# EAGLE design plugV15-smd-5x5cm-no-screen-value (EAGLE 7.5.0)
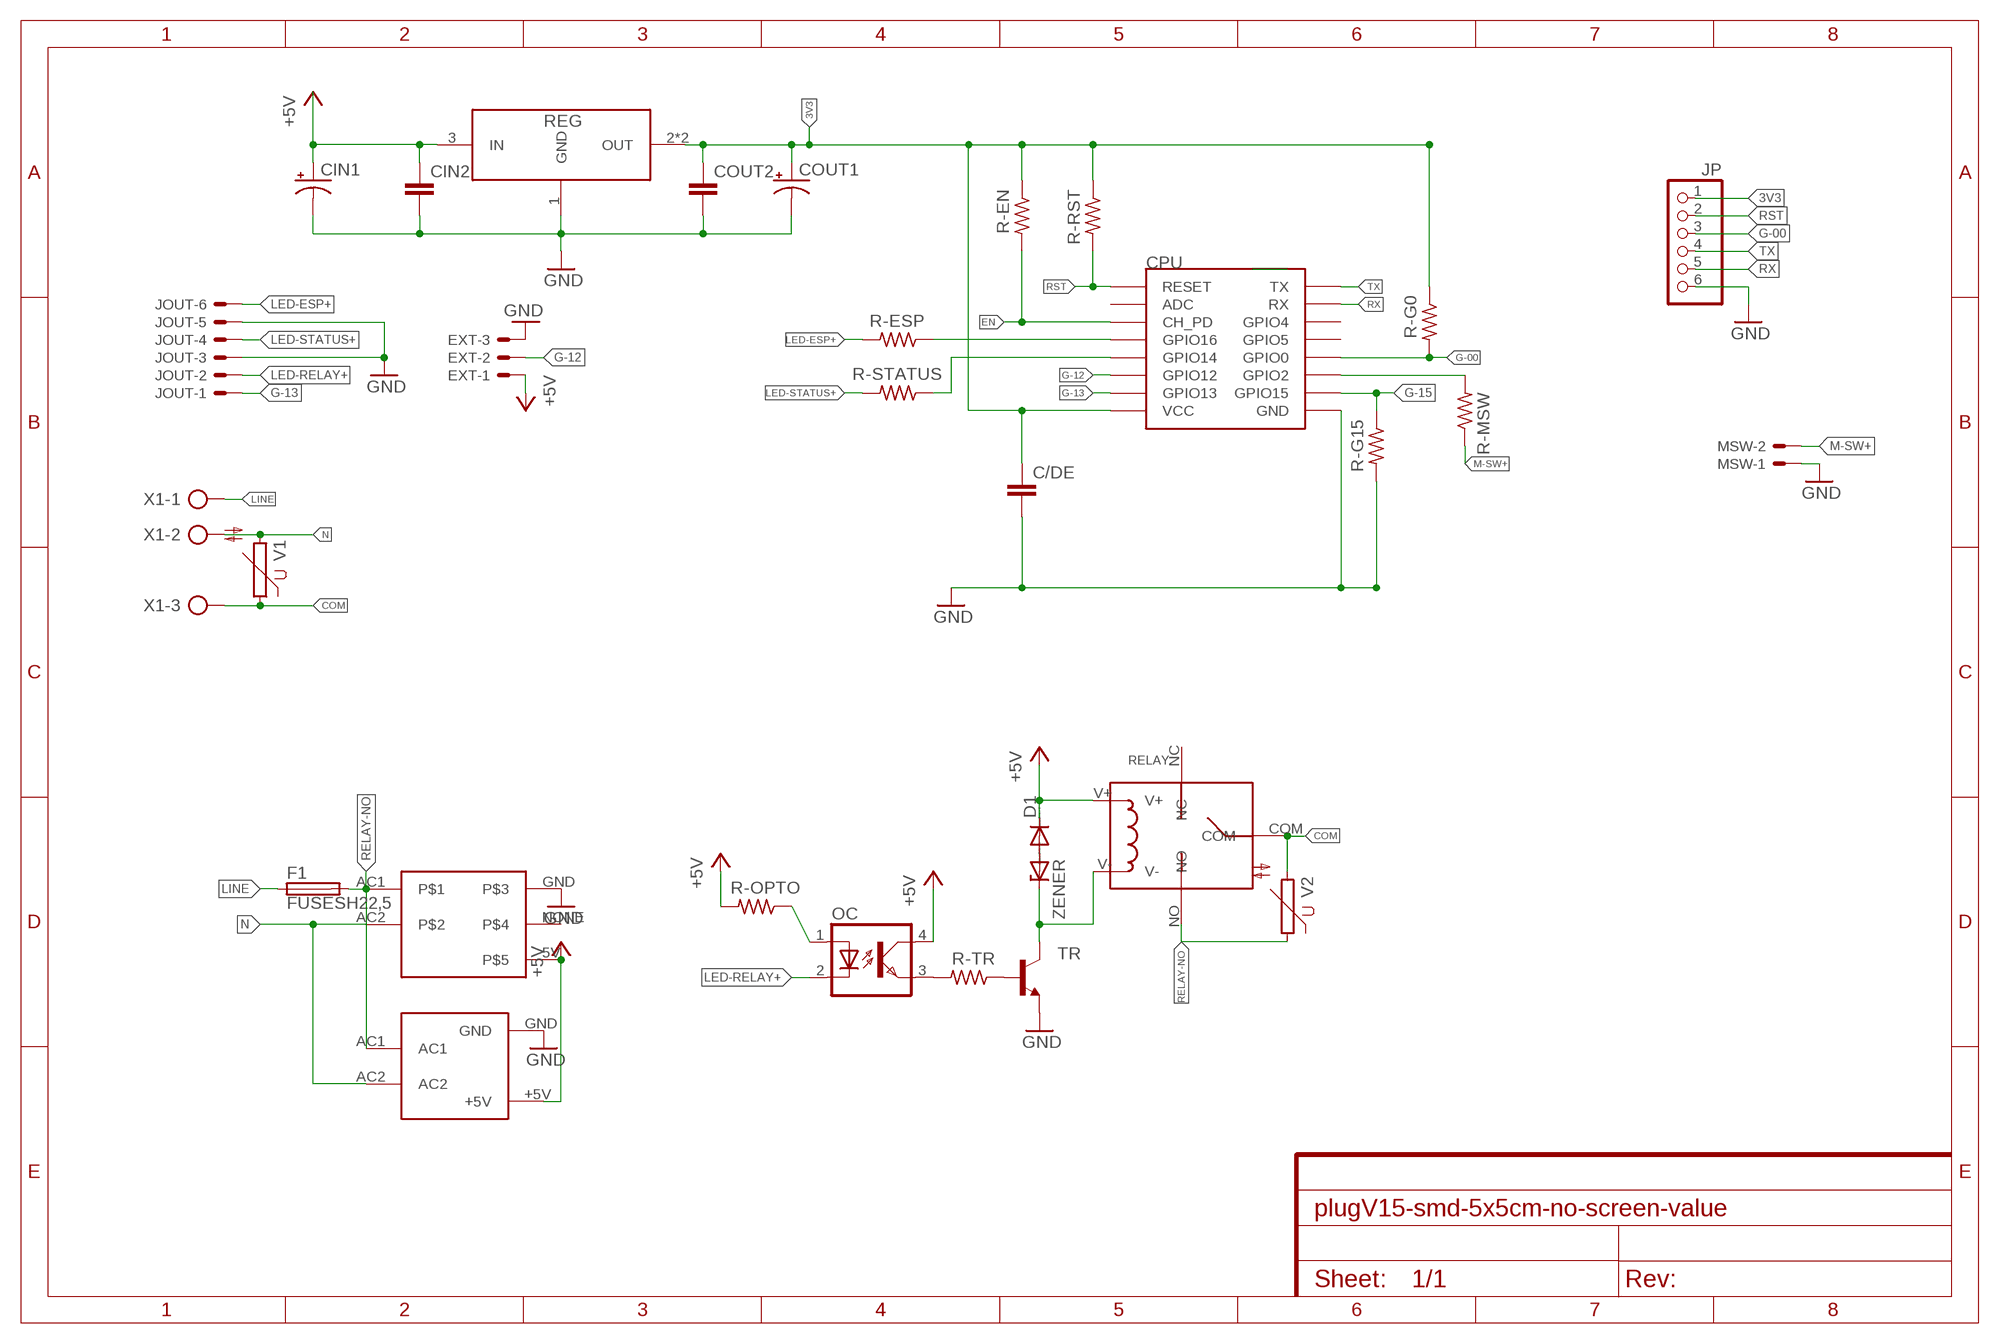
[diagram p0: schematic, sheet 1]

## Parts
C/DE  C-EUC0805  [C0805]
CIN1  CPOL-USE2.5-5  [E2,5-5]
CIN2  C-EUC0805  [C0805]
COUT1  CPOL-USE2.5-5  [E2,5-5]
COUT2  C-EUC0805  [C0805]
CPU  ESP12SMD  [ESP12-SMD]
D1  1N4148DO35-7  [DO35-7]
EXT  53048-03  [53048-03]
F1  FUSESH22,5  [SH22,5]
HLK  HLK-PM01  [HLK-PM01]
JOUT  53048-06  [53048-06]
JP  PINHD-1X6  [1X06]
MSW  53048-02  [53048-02]
OC  PC817  [DIL04]
R-EN  R-US_M0805  [M0805]
R-ESP  R-US_M0805  [M0805]
R-G0  R-US_M0805  [M0805]
R-G15  R-US_M0805  [M0805]
R-MSW  R-US_M0805  [M0805]
R-OPTO  R-US_M0805  [M0805]
R-RST  R-US_M0805  [M0805]
R-STATUS  R-US_M0805  [M0805]
R-TR  R-US_M0805  [M0805]
REG  AMS1117-3.3  [SOT-223]
RELAY  RELAY-SONGLE  [RELAY-SONGLE]
TR  BC817-16SMD  [SOT23-BEC]
U$4  POWERSUPPLY-5V-700MA  [POWERSUPPLY-5V-700MA]
V1  S14K11  [S14K11]
V2  S14K11  [S14K11]
X1  AK300/3  [AK300/3]
ZENER  1N4728  [DO41Z10]

## Nets
3V3: C/DE.1 COUT1.+ COUT2.1 CPU.VCC JP.1 R-EN.1 R-G0.1 R-RST.1 REG.2(OUT) REG.4(OUT)
+5V: CIN1.+ CIN2.1 D1.C EXT.1 HLK.+5V OC.4(COL) R-OPTO.2 REG.3(IN) RELAY.V+ U$4.5V
COM: RELAY.COM V1.1 V2.2 X1.3
EN: CPU.CH_PD R-EN.2
G-00: CPU.GPIO0 JP.3 R-G0.2
G-12: CPU.GPIO12 EXT.2
G-13: CPU.GPIO13 JOUT.1
G-15: CPU.GPIO15 R-G15.1
GND: C/DE.2 CIN1.- CIN2.2 COUT1.- COUT2.2 CPU.GND EXT.3 HLK.GND JOUT.3 JOUT.5 JP.6 MSW.1 R-G15.2 REG.1(GND) TR.E U$4.GND
LED-ESP+: JOUT.6 R-ESP.2
LED-RELAY+: JOUT.2 OC.2(C)
LED-STATUS+: JOUT.4 R-STATUS.2
LINE: F1.1 X1.1
M-SW+: MSW.2 R-MSW.1
N: HLK.AC2 U$4.AC2 V1.2 X1.2
N$1: OC.3(EMIT) R-TR.2
N$2: R-TR.1 TR.B
N$7: CPU.GPIO2 R-MSW.2
N$8: CPU.GPIO14 R-STATUS.1
N$13: OC.1(A) R-OPTO.1
N$16: D1.A ZENER.A
N$17: RELAY.V- TR.C ZENER.C
N$19: CPU.GPIO16 R-ESP.1
RELAY-NO: F1.2 HLK.AC1 RELAY.NO U$4.AC1 V2.1
RST: CPU.RESET JP.2 R-RST.2
RX: CPU.RXD0(RX) JP.5
TX: CPU.TXD0(TX) JP.4
Unconnected: CPU.ADC CPU.GPIO4 CPU.GPIO5 RELAY.NC U$4.NONE

## Library data of the parts
C/DE CIN2 COUT2 = rcl:C-EU: CAPACITOR, European symbol
CIN1 COUT1 = rcl:CPOL-US: POLARIZED CAPACITOR, American symbol
CPU = esp8266modules:ESP12: ESP8266 Wifi module 12
D1 = diode:1N4148: DIODE high speed (Philips)
EXT = con-molex:53?-03: CONNECTOR wire to board 1.25 mm (.049 inch) pitch header; MF: WALDOM/MOLEX; MPN: 53048-0310; OC_FARNELL: 9732918; OC_NEWARK: 38C9908
F1 = fuse:FUSE: Fuse; OC_FARNELL: unknown; OC_NEWARK: unknown
HLK = HLK-PM01:HLK-PM01
JOUT = con-molex:53?-06: CONNECTOR wire to board 1.25 mm (.049 inch) pitch header; MF: WALDOM/MOLEX; MPN: 53048-0610; OC_FARNELL: 1012260; OC_NEWARK: 38C9911
JP = pinhead:PINHD-1X6: PIN HEADER
MSW = con-molex:53?-02: CONNECTOR wire to board 1.25 mm (.049 inch) pitch header; MF: MOLEX; MPN: 53048-0210; OC_FARNELL: 1012259; OC_NEWARK: 57H4718
OC = optocoupler:PC817: SHARP OPTO COUPLER; MPN: PC817X4J000F; OC_FARNELL: 9707727; OC_NEWARK: 97K7059
R-EN R-ESP R-G0 R-G15 R-MSW R-OPTO R-RST R-STATUS R-TR = rcl:R-US_: RESISTOR, American symbol
REG = AMS1117-3.3:AMS1117-3.3: 1A LOW DROPOUT VOLTAGE REGULATOR
RELAY = Seeed-OPL-Relay:RELAY-SONGLE
TR = transistor-npn:BC817*: NPN Transistor
U$4 = PowerSupply-5V-700mA:POWERSUPPLY-5V-700MA
V1 V2 = varistor:S14K11: VARISTOR
X1 = con-ptr500:AK300/3: CONNECTOR; OC_FARNELL: unknown; OC_NEWARK: unknown
ZENER = diode:1N4728: Z DIODE 3.3 V, 1W, 5 percent

## Board
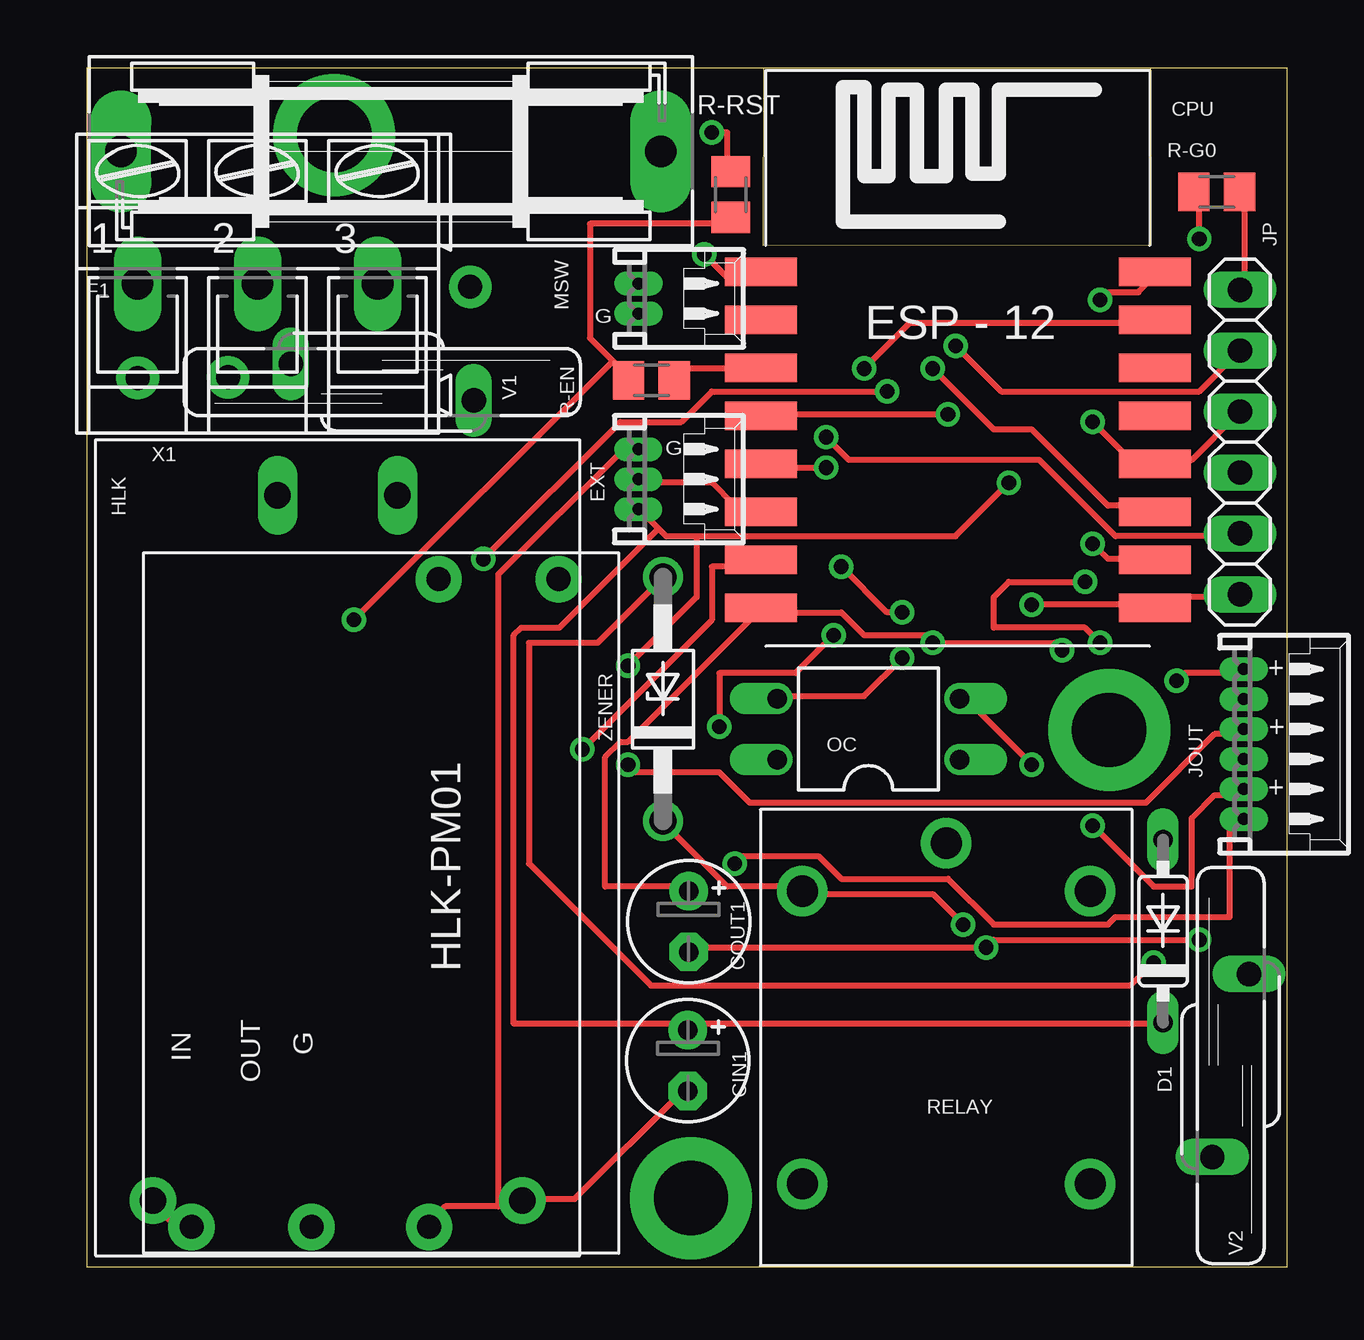
[diagram p1: board, top side]
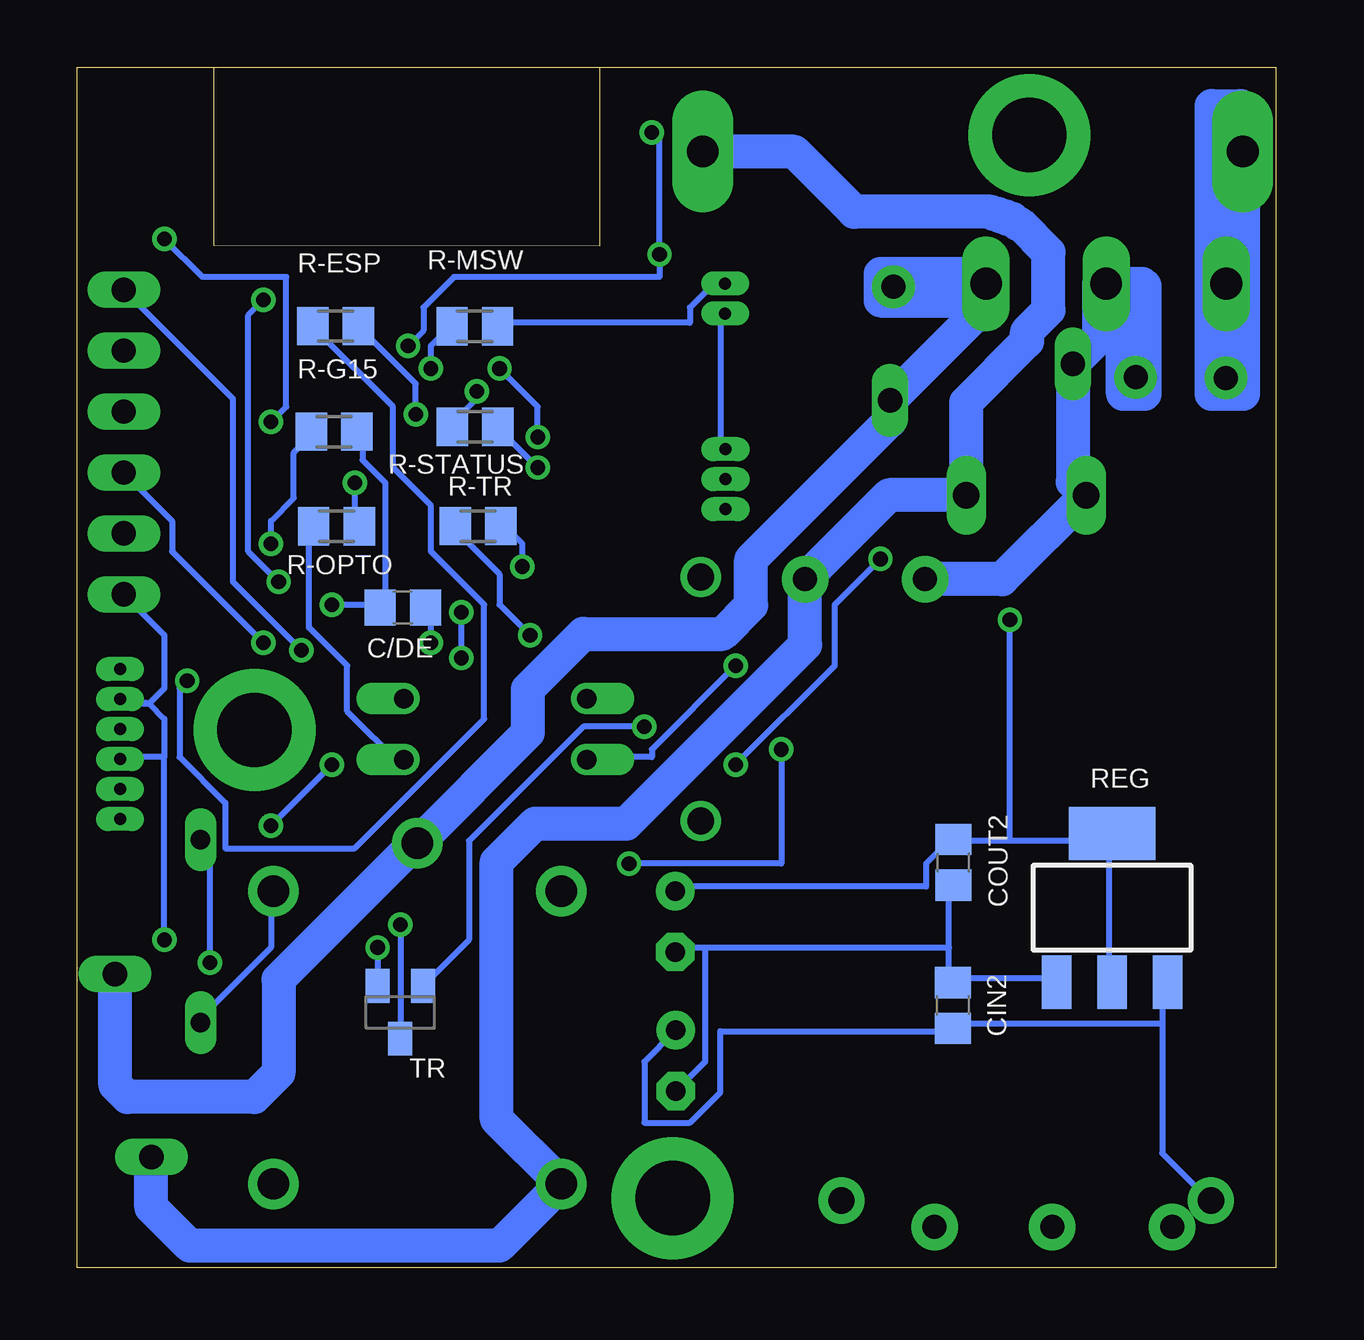
[diagram p2: board, bottom side, seen from below]

Size 50 x 50 mm. Coordinates in mm from the lower left corner, seen from the top.
Outline: 28.2,50 0,50 0,0 50,0 50,50 44.31,50
Outline: 28.2,50 28.19,42.59 44.3,42.6 44.31,50
Outline: 28.2,50 44.31,50
Copper layers (1*16): Top 0.035mm / dielectric 1.5mm / Bottom 0.035mm
Design rules "default": minimum track width 10mil, minimum drill 24mil, track to track 8mil, track to pad 8mil, pad to pad 8mil, via to via 8mil, smd to smd 8mil, copper to edge 40mil, drill to drill 8mil, minimum pad ring 10mil, minimum via ring 8mil, stop-mask expansion 4mil, vias tented up to drill 0mil, thermal gap 10mil

### Footprints (pad centres in the part's own frame; a part is rotated, then mirrored left to right if it is on the bottom)
C0805 = smd 1.3 x 1.5: 1 -0.95,0; 2 0.95,0
E2,5-5 = drill 0.813 pad 1.6: + -1.27,0 | drill 0.813 pad 1.6 octagon: - 1.27,0
ESP12-SMD = smd 3 x 1.2: ADC -8.3,3.8; CH_PD -8.3,1.8; GND 8.1,-8.2; GPIO0 8.1,-2.2; GPIO2 8.1,-4.2; GPIO4 8.1,1.8; GPIO5 8.1,-0.2; GPIO12 -8.3,-4.2; GPIO13 -8.3,-6.2; GPIO14 -8.3,-2.2; GPIO15 8.1,-6.2; GPIO16 -8.3,-0.2; RESET -8.3,5.8; RXD0 8.1,3.8; TXD0 8.1,5.8; VCC -8.3,-8.2
DO35-7 = drill 0.813 long: A 3.81,0; C -3.81,0
53048-03 = drill 0.5 pad 0.698 long: 1 1.25,-1.25; 2 0,-1.25; 3 -1.25,-1.25
SH22,5 = drill 1.321 pad 2.54 long: 1 -11.252,0; 2 11.252,0
HLK-PM01 = drill 1.1 pad 1.93: +5V 15.19,-7.76; GND 15.19,7.64 | drill 1.1 long: AC1 -14.21,2.44; AC2 -14.21,-2.56
53048-06 = drill 0.5 pad 0.698 long: 1 3.125,-1.25; 2 1.875,-1.25; 3 0.625,-1.25; 4 -0.625,-1.25; 5 -1.875,-1.25; 6 -3.125,-1.25
1X06 = drill 1.016 long: 1 -6.35,0; 2 -3.81,0; 3 -1.27,0; 4 1.27,0; 5 3.81,0; 6 6.35,0
53048-02 = drill 0.5 pad 0.698 long: 1 0.625,-1.25; 2 -0.625,-1.25
DIL04 = drill 0.813 offset: 1 -1.27,-3.81; 2 1.27,-3.81; 3 1.27,3.81; 4 -1.27,3.81
M0805 = smd 1.3 x 1.6: 1 -0.95,0; 2 0.95,0
SOT-223 = smd 1.219 x 2.235: 1 -2.381,-3.099; 2 -0.07,-3.099; 3 2.241,-3.099 | smd 3.6 x 2.2: 4 -0.07,3.099
RELAY-SONGLE = drill 1.3 pad 2.1: COM -8.1,0; NC 6.1,6; NO 6.1,-6; V+ -6.1,6; V- -6.1,-6
SOT23-BEC = smd 1 x 1.4: B -0.95,-1.1; C 0,1.1; E 0.95,-1.1
POWERSUPPLY-5V-700MA = drill 1 pad 1.93: 5V 13.5,-7.9; AC1 -13.5,7.4; AC2 -13.5,2.4; GND 13.5,2; NONE 13.5,-2.9
S14K11 = drill 1.016 long: 1 -0.762,-3.81; 2 0.762,3.81
AK300/3 = drill 1.321 long: 1 -5.004,0; 2 0,0; 3 5.004,0
DO41Z10 = drill 1.118: A 5.08,0; C -5.08,0

### Placement (x,y rotation side)
C/DE  36.42,27.51 180 bottom
CIN1  25.04,8.62 270 top
CIN2  13.49,10.92 90 bottom
COUT1  25.07,14.42 270 top
COUT2  13.48,16.88 270 bottom
CPU  36.39,35.69 0 top
D1  44.84,14.02 90 top
EXT  24.22,32.85 270 top
F1  12.66,46.52 0 top
HLK  10.49,17.98 270 top
JOUT  49.46,21.81 270 top
JP  48.05,34.4 270 top
MSW  24.23,40.39 270 top
OC  32.56,22.44 90 top
R-EN  23.52,36.97 0 top
R-ESP  39.22,39.23 180 bottom
R-G0  47.08,44.82 180 top
R-G15  39.28,34.84 0 bottom
R-MSW  33.42,39.22 180 bottom
R-OPTO  39.18,30.89 0 bottom
R-RST  26.82,44.72 90 top
R-STATUS  33.4,35.04 180 bottom
R-TR  33.28,30.9 0 bottom
REG  6.78,14.99 0 bottom
RELAY  35.81,9.58 270 top
TR  36.53,10.63 180 bottom
U$4  12.25,15.19 270 top
V1  12.3,36.9 90 top
V2  47.66,8.41 0 top
X1  7.1,41 0 top
ZENER  24,23.69 90 top

### Tracks (layer width: path | path; a pad name or v marks a point on that pad's centre or on a via)
3V3  (via drill 0.61)
  Top 0.254: R-G0.1 48.26,44.77 48.26,40.96 JP.1 | v40.64,25.72 40.32,26.04 v35.24,26.04 34.92,26.35 32.38,26.35 31.43,27.3 28.26,27.3 CPU.VCC 27.94,27.3 22.54,21.91 22.23,21.91 21.59,21.27 21.59,15.88 24.77,15.88 COUT1.+ | 21.91,37.78 20.95,38.73 20.95,43.5 26.67,43.5 R-RST.1 | 21.91,37.78 22.54,37.15 R-EN.1 | v11.11,26.99 21.91,37.78
  Bottom 0.254: v35.24,26.04 35.24,27.3 C/DE.1 | v40.64,25.72 43.5,28.57 43.5,36.2 47.94,40.64 JP.1 | 6.99,17.78 11.11,17.78 | 11.11,17.78 13.34,17.78 COUT2.1 13.65,17.78 14.61,16.83 14.61,15.88 24.77,15.88 COUT1.+ | 6.99,17.78 6.99,12.06 REG.2 | 6.99,17.78 REG.4 | 11.11,17.78 v11.11,26.99
+5V  (via drill 0.61)
  Top 0.254: v38.42,32.7 36.2,30.48 25.4,30.48 | 25.4,30.48 24.13,30.48 23.81,30.8 | 23.81,30.8 23.18,31.43 EXT.1 | v22.54,25.08 25.4,27.94 25.4,30.48 | HLK.+5V 2.86,2.54 3.49,1.91 4.13,1.91 U$4.5V | D1.C 44.77,10.16 25.08,10.16 CIN1.+ 24.77,10.16 17.78,10.16 17.78,26.35 18.1,26.67 19.68,26.67 23.81,30.8
  Bottom 0.254: v38.42,32.7 38.42,31.11 R-OPTO.2 | v22.54,25.08 26.04,21.59 26.04,21.27 28.57,21.27 OC.4 | 4.76,10.16 13.34,10.16 CIN2.1 13.65,9.84 23.18,9.84 23.18,7.3 24.45,6.03 26.35,6.03 26.35,8.57 25.08,9.84 CIN1.+ | 4.76,10.16 4.76,11.75 REG.3 | 4.76,10.16 4.76,4.76 2.86,2.86 HLK.+5V | D1.C 44.77,10.48 41.91,13.34 41.91,15.56 RELAY.V+
COM
  Bottom 1.422: V2.2 48.4,12.2 48.4,7.6 47.9,7.1 42.6,7.1 41.6,8.1 41.6,12 35.92,17.68 RELAY.COM 31.2,22.29 31.2,24.1 28.9,26.4 23.1,26.4 21.9,27.6 21.9,29.5 16.11,35.29 V1.1 12.1,40.15 12.1,40.3 16.5,40.3 16.5,41.4 12.1,41.4 X1.3
EN
  Top 0.254: R-EN.2 24.77,37.15 25.08,37.47 27.94,37.47 CPU.CH_PD
G-00  (via drill 0.61)
  Top 0.254: v46.35,42.86 46.35,44.77 R-G0.2 | v41.91,35.24 43.5,33.66 44.45,33.66 CPU.GPIO0 44.77,33.66 46.04,33.66 47.94,35.56 JP.3
  Bottom 0.254: v46.35,42.86 44.77,41.27 41.27,41.27 41.27,35.88 v41.91,35.24
G-12
  Top 0.254: EXT.2 23.18,32.7 26.04,32.7 26.99,31.75 27.94,31.75 CPU.GPIO12
G-13  (via drill 0.61)
  Top 0.254: v26.99,16.83 27.3,17.14 30.48,17.14 31.43,16.19 35.88,16.19 37.78,14.29 42.55,14.29 42.86,14.61 47.62,14.61 47.62,18.41 JOUT.1 | v20.64,21.59 26.04,26.99 26.04,29.21 27.94,29.21 CPU.GPIO13
  Bottom 0.254: v26.99,16.83 20.64,16.83 v20.64,21.59
G-15  (via drill 0.61)
  Top 0.254: v41.91,30.16 42.55,29.53 44.45,29.53 CPU.GPIO15
  Bottom 0.254: v41.91,30.16 41.91,31.11 40.96,32.07 40.96,33.97 40.32,34.61 R-G15.1
GND  (via drill 0.61)
  Top 0.254: CIN1.- 24.77,7.3 20.32,2.86 18.41,2.86 HLK.GND 18.1,2.54 17.14,2.54 | 17.14,2.54 14.92,2.54 14.29,1.91 U$4.GND | 17.14,2.54 17.14,28.89 22.23,33.97 22.86,33.97 EXT.3 | JP.6 47.94,27.94 45.09,27.94 44.77,27.62 CPU.GND 44.45,27.62 v39.37,27.62 | COUT1.- 25.08,13.34 v37.47,13.34 37.78,13.65 v46.35,13.65
  Bottom 0.254: EXT.3 23.18,34.29 23.18,39.69 MSW.1 | R-G15.2 38.1,34.61 38.1,33.66 37.15,32.7 37.15,27.62 C/DE.2 37.47,27.62 v39.37,27.62 | 46.35,21.27 47.62,21.27 JOUT.3 | 46.35,21.27 46.35,22.86 46.99,23.5 | 46.99,23.5 47.62,23.5 JOUT.5 46.99,23.5 | 46.99,23.5 46.35,24.13 46.35,26.35 47.94,27.94 JP.6 | 13.65,13.34 13.65,12.06 CIN2.2 13.34,12.06 9.21,12.06 REG.1 | 13.65,13.34 13.65,15.88 COUT2.2 | v37.47,13.34 37.47,11.75 TR.E | 23.81,13.34 24.77,13.34 COUT1.- | 23.81,13.34 13.65,13.34 | v46.35,13.65 46.35,21.27 | 23.81,13.34 23.81,8.57 24.77,7.62 CIN1.-
LED-ESP+  (via drill 0.61)
  Top 0.254: v45.4,24.45 45.72,24.77 47.62,24.77 JOUT.6
  Bottom 0.254: v45.4,24.45 45.72,24.13 45.72,21.27 43.81,19.37 43.81,17.46 38.42,17.46 33.02,22.86 33.02,27.62 35.24,29.84 35.24,31.75 36.83,33.34 36.83,35.88 40.01,39.05 R-ESP.2
LED-RELAY+  (via drill 0.61)
  Top 0.254: v41.91,18.41 44.45,15.88 46.04,15.88 46.04,18.73 46.99,19.68 47.62,19.68 JOUT.2 | v39.37,20.95 36.83,23.5 36.51,23.5 OC.2
  Bottom 0.254: v39.37,20.95 v41.91,18.41
LED-STATUS+  (via drill 0.61)
  Top 0.254: v33.34,36.51 26.04,36.51 24.77,35.24 22.23,35.24 v16.51,29.53 | v22.54,20.95 22.86,20.64 26.35,20.64 27.62,19.37 44.13,19.37 46.99,22.23 47.62,22.23 JOUT.4
  Bottom 0.254: v33.34,36.51 33.34,36.2 34.29,35.24 R-STATUS.2 | v16.51,29.53 18.41,27.62 18.41,25.08 v22.54,20.95
LINE
  Bottom 1.422: F1.1 1.41,36.41 1.4,36.4 2.7,36.4 2.7,48.4 1.5,48.4 1.5,41.6 X1.1
M-SW+
  Bottom 0.254: R-MSW.1 32.38,39.37 24.45,39.37 24.45,40.01 23.18,41.27 MSW.2
N
  Bottom 1.422: U$4.AC2 11.44,28.69 HLK.AC2 8.49,32.74 V1.2 7.4,38.75 7.4,41 X1.2 6.3,41 | 6.3,41 5.6,41 5.5,40.9 5.5,36.4 6.4,36.4 6.4,40.9 6.3,41
N$1  (via drill 0.61)
  Top 0.254: v31.43,29.21 33.34,27.3 v33.97,27.3 | v33.97,25.4 32.38,23.81 28.89,23.81 OC.3
  Bottom 0.254: v31.43,29.21 31.43,30.16 32.07,30.8 R-TR.2 | v33.97,25.4 v33.97,27.3
N$2  (via drill 0.61)
  Top 0.254: v26.35,22.54 26.35,24.77 29.53,24.77 v31.11,26.35
  Bottom 0.254: v26.35,22.54 28.89,22.54 33.66,17.78 33.66,13.65 35.56,11.75 TR.B | v31.11,26.35 32.38,27.62 32.38,28.89 33.97,30.48 33.97,30.8 R-TR.1
N$3  (via drill 3.1 pad 5.08)
  other vias: 25.17,2.89
N$7  (via drill 0.61)
  Top 0.254: v35.24,37.47 37.78,34.92 39.37,34.92 42.55,31.75 44.45,31.75 CPU.GPIO2
  Bottom 0.254: v35.24,37.47 35.24,38.42 34.61,39.05 R-MSW.2
N$8  (via drill 0.61)
  Top 0.254: v30.8,33.34 28.26,33.34 CPU.GPIO14
  Bottom 0.254: v30.8,33.34 32.38,34.92 R-STATUS.1
N$9  (via drill 3.1 pad 5.08)
  other vias: 42.6,22.4
N$13
  Bottom 0.254: R-OPTO.1 40.32,30.8 40.32,26.67 38.73,25.08 38.73,23.18 36.51,20.95 OC.1
N$16  (via drill 0.61)
  Top 0.254: v44.45,12.7 43.5,11.75 23.5,11.75 18.41,16.83 18.41,26.04 21.27,26.04 23.81,28.57 ZENER.A
  Bottom 0.254: v44.45,12.7 44.45,17.46 44.77,17.78 D1.A
N$17  (via drill 0.61)
  Top 0.254: v36.51,14.29 35.24,15.56 29.84,15.56 RELAY.V- 29.53,15.88 26.67,15.88 24.13,18.41 ZENER.C
  Bottom 0.254: v36.51,14.29 36.51,9.84 TR.C
N$18  (via drill 3.1 pad 5.08)
  other vias: 10.3,47.2
N$19  (via drill 0.61)
  Top 0.254: v35.88,35.56 28.26,35.56 CPU.GPIO16
  Bottom 0.254: v35.88,35.56 35.88,36.83 38.1,39.05 R-ESP.1
N$20  (via drill 1 pad 1.78)
  other vias: 2.11,37.07
N$21  (via drill 1 pad 1.78)
  other vias: 5.87,37.1
N$22  (via drill 1 pad 1.78)
  other vias: 15.97,40.87
RELAY-NO
  Bottom 1.422: V2.1 46.9,2.5 45.3,0.9 32.39,0.9 RELAY.NO 32.5,6.17 32.5,16.9 30.9,18.5 27.1,18.5 19.65,25.95 U$4.AC1 16.15,32.19 HLK.AC1 12.94,36.06 10.4,38.6 10.4,39 9.5,39.9 9.5,42.3 10.7,43.5 10.8,43.5 11,43.7 11.2,43.7 11.3,43.8 11.5,43.8 11.6,43.9 11.8,43.9 11.9,44 17.6,44 20.1,46.5 23.89,46.5 F1.2
RST  (via drill 0.61)
  Top 0.254: v26.04,47.31 26.67,47.31 26.67,45.72 R-RST.2 | v25.72,42.23 26.67,41.27 27.94,41.27 CPU.RESET | v36.2,38.42 38.1,36.51 46.35,36.51 47.94,38.1 JP.2
  Bottom 0.254: v26.04,47.31 25.72,46.99 v25.72,42.23 25.72,41.27 34.29,41.27 35.56,40.01 35.56,39.05 v36.2,38.42
RX  (via drill 0.61)
  Top 0.254: v32.38,37.47 34.29,39.37 44.45,39.37 CPU.RXD0 | v30.8,34.61 31.75,33.66 39.69,33.66 42.86,30.48 47.94,30.48 JP.5
  Bottom 0.254: v32.38,37.47 30.8,35.88 v30.8,34.61
TX  (via drill 0.61)
  Top 0.254: v42.23,40.32 42.55,40.64 43.81,40.64 44.45,41.27 CPU.TXD0 | v41.59,28.57 38.42,28.57 37.78,27.94 37.78,26.67 41.59,26.67 v42.23,26.04
  Bottom 0.254: v42.23,40.32 42.86,39.69 42.86,29.84 v41.59,28.57 | v42.23,26.04 46.04,29.84 46.04,31.11 47.94,33.02 JP.4

### Text on the board
tNames: G | G | + | + | + | IN | G | OUT